# EAGLE schematic teensyBoard_1.1 (EAGLE 6.6.0)
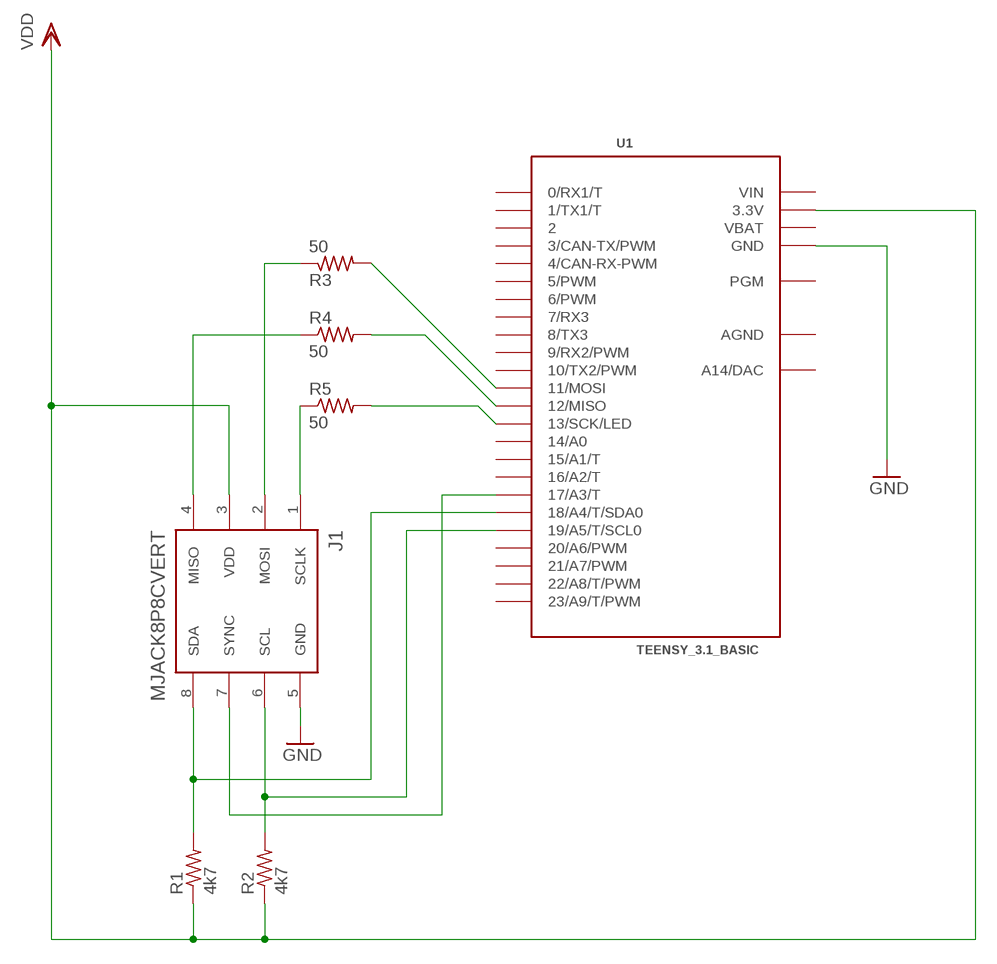
[diagram p0: schematic, sheet 1]

## Parts
J1  MJACK8P8CVERT  [MJACK8P8C]
R1  4k7  R-US_R0603  [R0603]
R2  4k7  R-US_R0603  [R0603]
R3  50  R-US_R0603  [R0603]
R4  50  R-US_R0603  [R0603]
R5  50  R-US_R0603  [R0603]
U1  TEENSY_3.1_BASIC  [TEENSY_3.1_BASIC]

## Nets
GND: J1.5(GND) U1.GND U1.GND1(GND)
N$2: R3.2 U1.11(11/MOSI)
N$3: J1.6(SCL) R2.2 U1.19/A5(19/A5/T/SCL0)
N$4: J1.4(MISO) R4.1
N$5: R4.2 U1.12(12/MISO)
N$6: J1.1(SCLK) R5.1
N$7: R5.2 U1.13(13/SCK/LED)
N$8: J1.8(SDA) R1.2 U1.18/A4(18/A4/T/SDA0)
N$9: J1.7(SYNC) U1.17/A3(17/A3/T)
N$10: J1.2(MOSI) R3.1
VDD: J1.3(VDD) R1.1 R2.1 U1.3.3V U1.3.3V1(3.3V)
Unconnected: U1.0(0/RX1/T) U1.1(1/TX1/T) U1.2 U1.3(3/CAN-TX/PWM) U1.4(4/CAN-RX-PWM) U1.5(5/PWM) U1.6(6/PWM) U1.7(7/RX3) U1.8(8/TX3) U1.9(9/RX2/PWM) U1.10(10/TX2/PWM) U1.14/A0 U1.15/A1(15/A1/T) U1.16/A2(16/A2/T) U1.20/A6(20/A6/PWM) U1.21/A7(21/A7/PWM) U1.22/A8(22/A8/T/PWM) U1.23/A9(23/A9/T/PWM) U1.A14(A14/DAC) U1.PGM

## Power pins joined to a net without a drawn wire
AGND: U1.AGND
VBAT: U1.VBAT
VIN: U1.VIN

## Library data of the parts
J1 = wavemeter:MJACK8P8C: Vertical Plastic 8P8C Modular Jack w/ Ears (Ethernet Jacks - Wurth Electronics - 615008144221)
R1-R5 = resistor:R-US_: RESISTOR, American symbol
U1 = mcu-accessories:TEENSY_3.1_BASIC: Footprint for Teensy 3.1 board using all pin connections on the outer perimeter